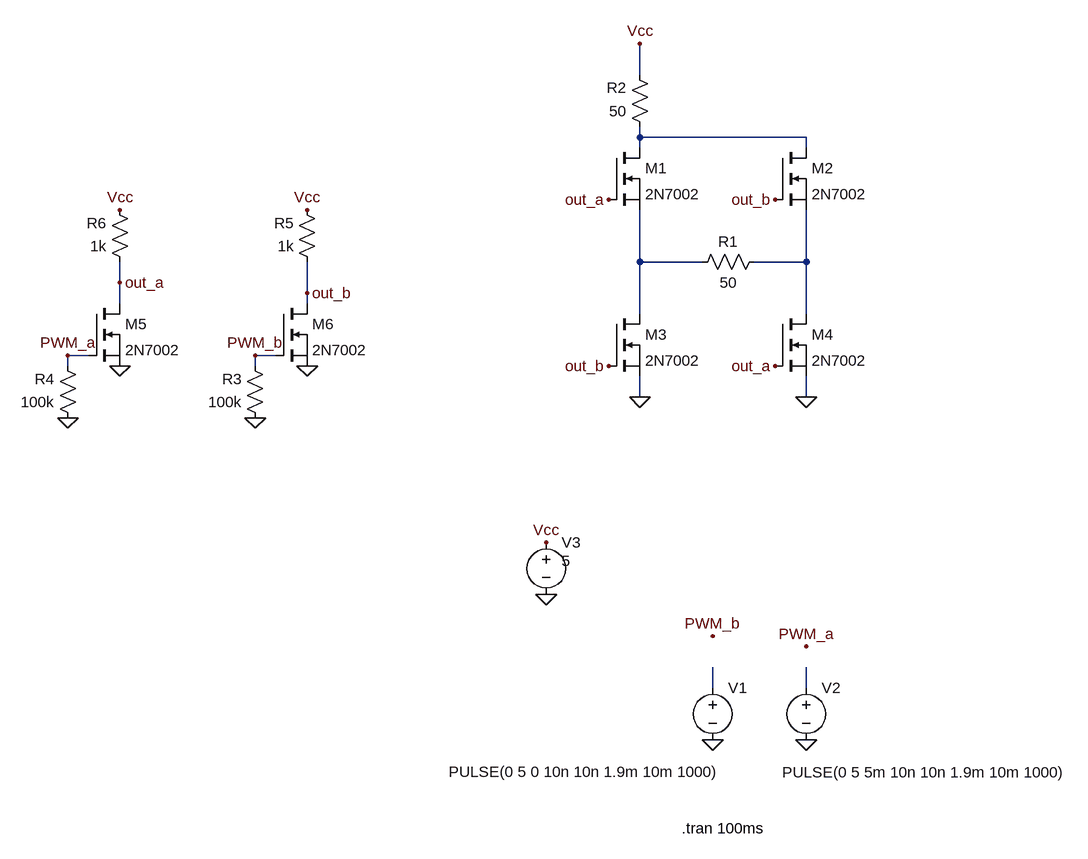
[diagram p0: schematic Draft1.asc]
Draft1.asc, the LTspice schematic file:
Version 4
SHEET 1 880 1064
WIRE 64 -112 64 -160
WIRE 64 -16 64 -32
WIRE 320 -16 64 -16
WIRE 64 0 64 -16
WIRE 320 0 320 -16
WIRE 64 176 64 96
WIRE 160 176 64 176
WIRE 320 176 320 96
WIRE 320 176 240 176
WIRE -736 208 -736 176
WIRE -448 224 -448 176
WIRE -736 240 -736 208
WIRE -448 240 -448 224
WIRE 64 256 64 176
WIRE 320 256 320 176
WIRE -784 320 -816 320
WIRE -496 320 -528 320
WIRE -816 336 -816 320
WIRE -528 336 -528 320
WIRE 64 384 64 352
WIRE 320 384 320 352
WIRE 176 832 176 800
WIRE 320 832 320 800
FLAG 320 384 0
FLAG 64 384 0
FLAG 176 912 0
FLAG -80 608 Vcc
FLAG 64 -160 Vcc
FLAG -80 688 0
FLAG 320 912 0
FLAG 320 768 PWM_a
FLAG 176 752 PWM_b
FLAG -448 336 0
FLAG -736 336 0
FLAG -736 96 Vcc
FLAG -448 96 Vcc
FLAG -528 416 0
FLAG -816 416 0
FLAG -528 320 PWM_b
FLAG -816 320 PWM_a
FLAG -736 208 out_a
FLAG -448 224 out_b
FLAG 16 80 out_a
FLAG 272 336 out_a
FLAG 16 336 out_b
FLAG 272 80 out_b
SYMBOL res 256 160 R90
WINDOW 0 0 56 VBottom 2
WINDOW 3 32 56 VTop 2
SYMATTR InstName R1
SYMATTR Value 50
SYMBOL voltage 176 816 R0
WINDOW 3 -406 145 Left 2
WINDOW 123 0 0 Left 0
WINDOW 39 0 0 Left 0
SYMATTR Value PULSE(0 5 0 10n 10n 1.9m 10m 1000)
SYMATTR InstName V1
SYMBOL voltage 320 816 R0
WINDOW 3 -37 146 Left 2
WINDOW 123 0 0 Left 0
WINDOW 39 0 0 Left 0
SYMATTR Value PULSE(0 5 5m 10n 10n 1.9m 10m 1000)
SYMATTR InstName V2
SYMBOL voltage -80 592 R0
WINDOW 3 24 44 Left 2
WINDOW 123 0 0 Left 0
WINDOW 39 0 0 Left 0
SYMATTR Value 5
SYMATTR InstName V3
SYMBOL nmos 16 256 R0
SYMATTR InstName M3
SYMATTR Value 2N7002
SYMBOL nmos 272 256 R0
SYMATTR InstName M4
SYMATTR Value 2N7002
SYMBOL nmos 16 0 R0
SYMATTR InstName M1
SYMATTR Value 2N7002
SYMBOL nmos 272 0 R0
SYMATTR InstName M2
SYMATTR Value 2N7002
SYMBOL res 80 -16 R180
WINDOW 0 36 76 Left 2
WINDOW 3 36 40 Left 2
SYMATTR InstName R2
SYMATTR Value 50
SYMBOL nmos -784 240 R0
SYMATTR InstName M5
SYMATTR Value 2N7002
SYMBOL nmos -496 240 R0
SYMATTR InstName M6
SYMATTR Value 2N7002
SYMBOL res -432 192 R180
WINDOW 0 36 76 Left 2
WINDOW 3 36 40 Left 2
SYMATTR InstName R5
SYMATTR Value 1k
SYMBOL res -720 192 R180
WINDOW 0 36 76 Left 2
WINDOW 3 36 40 Left 2
SYMATTR InstName R6
SYMATTR Value 1k
SYMBOL res -512 432 R180
WINDOW 0 36 76 Left 2
WINDOW 3 36 40 Left 2
SYMATTR InstName R3
SYMATTR Value 100k
SYMBOL res -800 432 R180
WINDOW 0 36 76 Left 2
WINDOW 3 36 40 Left 2
SYMATTR InstName R4
SYMATTR Value 100k
TEXT 128 1048 Left 2 !.tran 100ms

The netlist it stands for:
* Draft1.asc
R1 N003 N002 50
V1 N004 0 PULSE(0 5 0 10n 10n 1.9m 10m 1000)
V2 N005 0 PULSE(0 5 5m 10n 10n 1.9m 10m 1000)
V3 Vcc 0 5
M3 N002 out_b 0 0 2N7002
M4 N003 out_a 0 0 2N7002
M1 N001 out_a N002 N002 2N7002
M2 N001 out_b N003 N003 2N7002
R2 N001 Vcc 50
M5 out_a PWM_a 0 0 2N7002
M6 out_b PWM_b 0 0 2N7002
R5 out_b Vcc 1k
R6 out_a Vcc 1k
R3 0 PWM_b 100k
R4 0 PWM_a 100k
.model NMOS NMOS
.model PMOS PMOS
.lib standard.mos
.tran 100ms
.backanno
.end